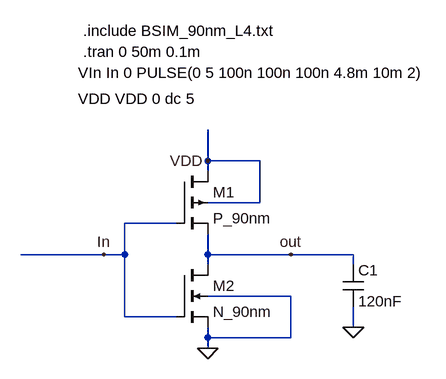
[diagram p0: schematic Part1.asc]
Part1.asc, the LTspice schematic file:
Version 4
SHEET 1 1124 680
WIRE 112 32 112 -16
WIRE 192 32 112 32
WIRE 112 48 112 32
WIRE 192 96 192 32
WIRE 192 96 112 96
WIRE 64 128 -16 128
WIRE -48 176 -176 176
WIRE -16 176 -16 128
WIRE -16 176 -48 176
WIRE 112 176 112 144
WIRE 240 176 112 176
WIRE 336 176 240 176
WIRE 112 192 112 176
WIRE 336 192 336 176
WIRE 240 240 112 240
WIRE -16 272 -16 176
WIRE 64 272 -16 272
WIRE 336 288 336 256
WIRE 112 304 112 288
WIRE 240 304 240 240
WIRE 240 304 112 304
WIRE 112 320 112 304
FLAG 112 320 0
FLAG -48 176 In
FLAG 112 32 VDD
FLAG 240 176 out
FLAG 336 288 0
SYMBOL pmos4 64 48 R0
SYMATTR InstName M1
SYMATTR Value P_90nm
SYMATTR Value2 l=90nm w=1800nm
SYMBOL nmos4 64 192 R0
SYMATTR InstName M2
SYMATTR Value N_90nm
SYMATTR Value2 l=90nm w=1800nm
SYMBOL cap 320 192 R0
SYMATTR InstName C1
SYMATTR Value 120nF
TEXT -88 -64 Left 2 !VDD VDD 0 dc 5
TEXT -88 -104 Left 2 !VIn In 0 PULSE(0 5 100n 100n 100n 4.8m 10m 2)
TEXT -80 -136 Left 2 !.tran 0 50m 0.1m
TEXT -80 -168 Left 2 !.include BSIM_90nm_L4.txt

The netlist it stands for:
* Part1.asc
M1 VDD In out VDD P_90nm l=90nm w=1800nm
M2 out In 0 0 N_90nm l=90nm w=1800nm
C1 out 0 120nF
.model NMOS NMOS
.model PMOS PMOS
.lib standard.mos
VDD VDD 0 dc 5
VIn In 0 PULSE(0 5 100n 100n 100n 4.8m 10m 2)
.tran 0 50m 0.1m
.include BSIM_90nm_L4.txt
.backanno
.end

* Results of the author's LTspice run, read from the files saved beside the schematic
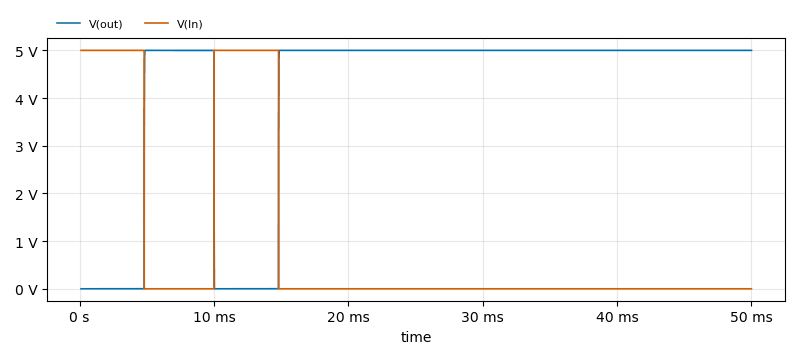
[diagram p1: Transient Analysis of Part1.asc, plotted from the saved traces]
* Transient Analysis, 1 run:
*   V(out): min 3.963 µV, max 5 V, average 4.047 V, rms 4.497 V, last 5 V
*   V(In): min 0 V, max 5 V, average 951.9 mV, rms 2.182 V, last 0 V